# EAGLE board SDA396 (EAGLE 9.6.2), part 1 of 5
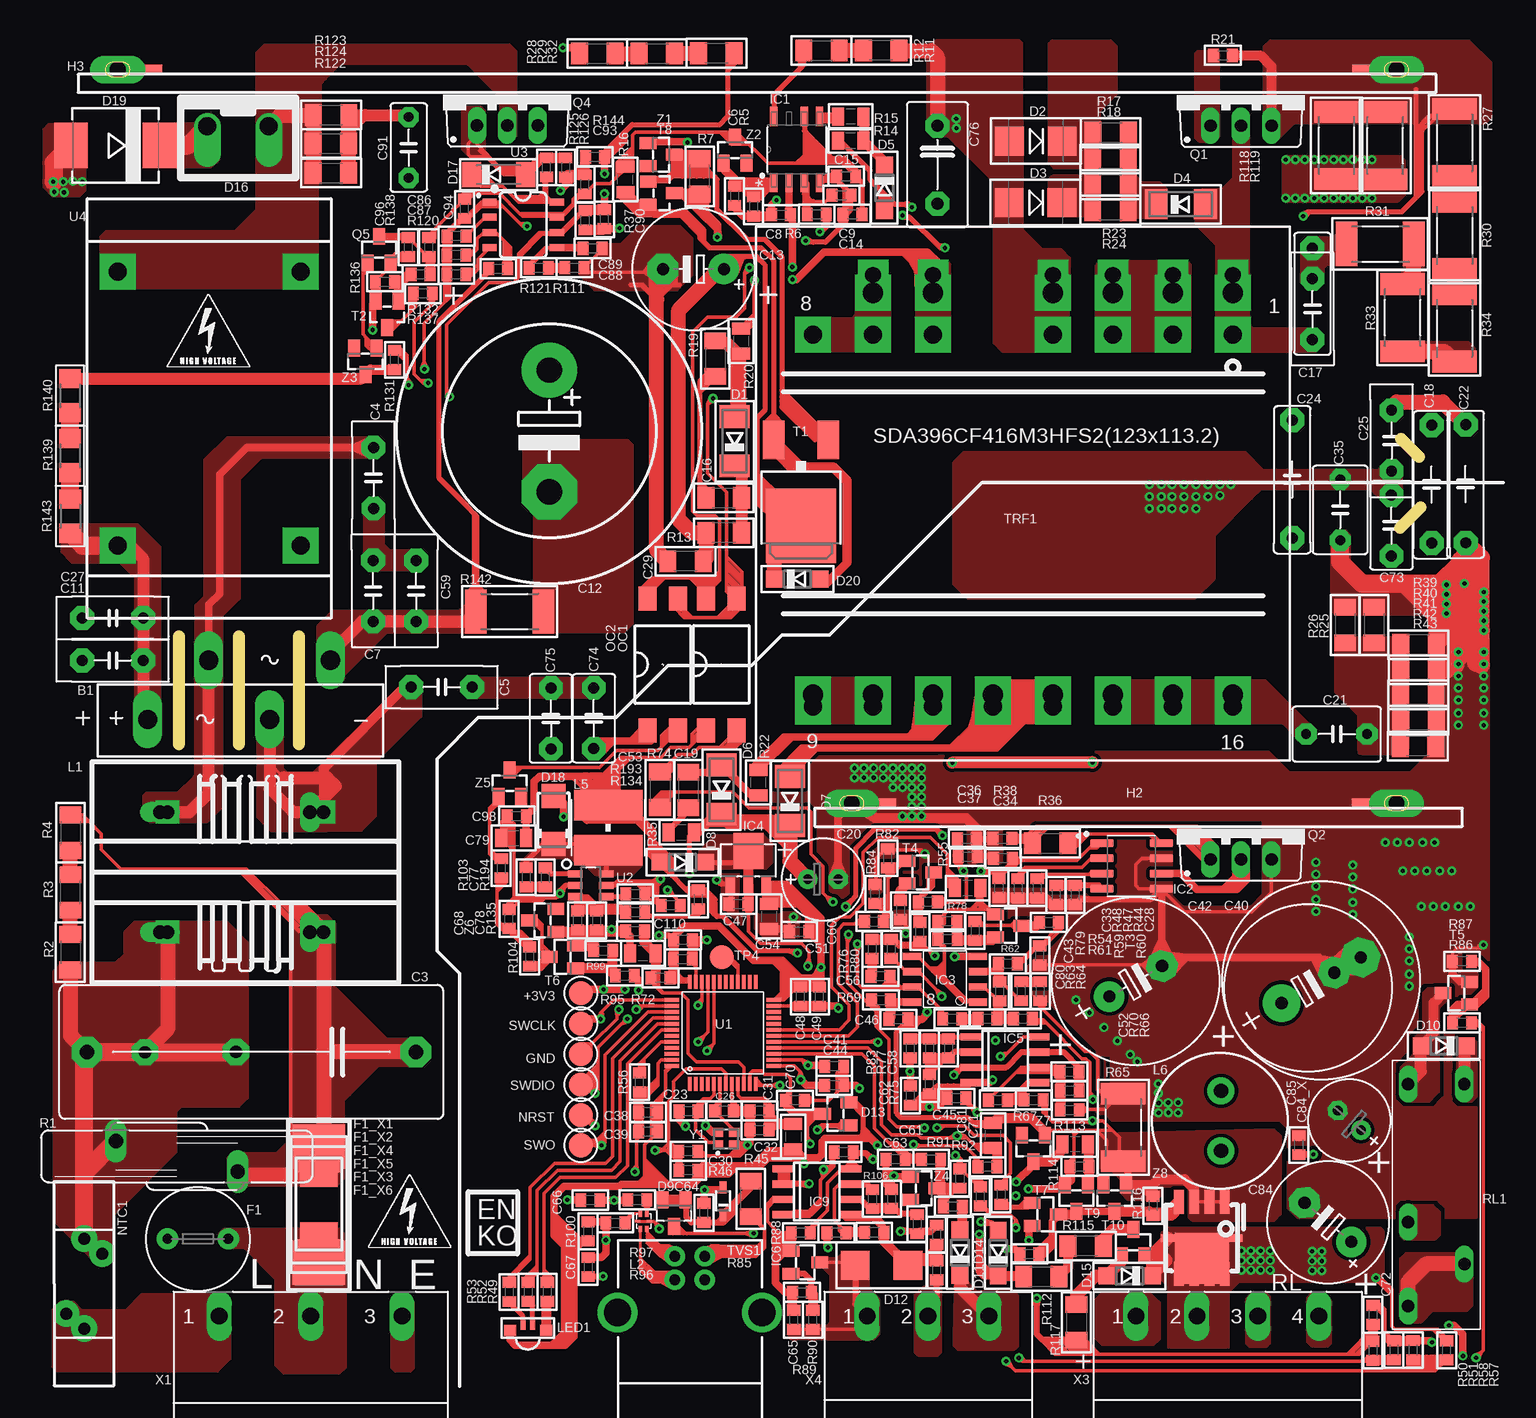
[diagram p3: board, top side]
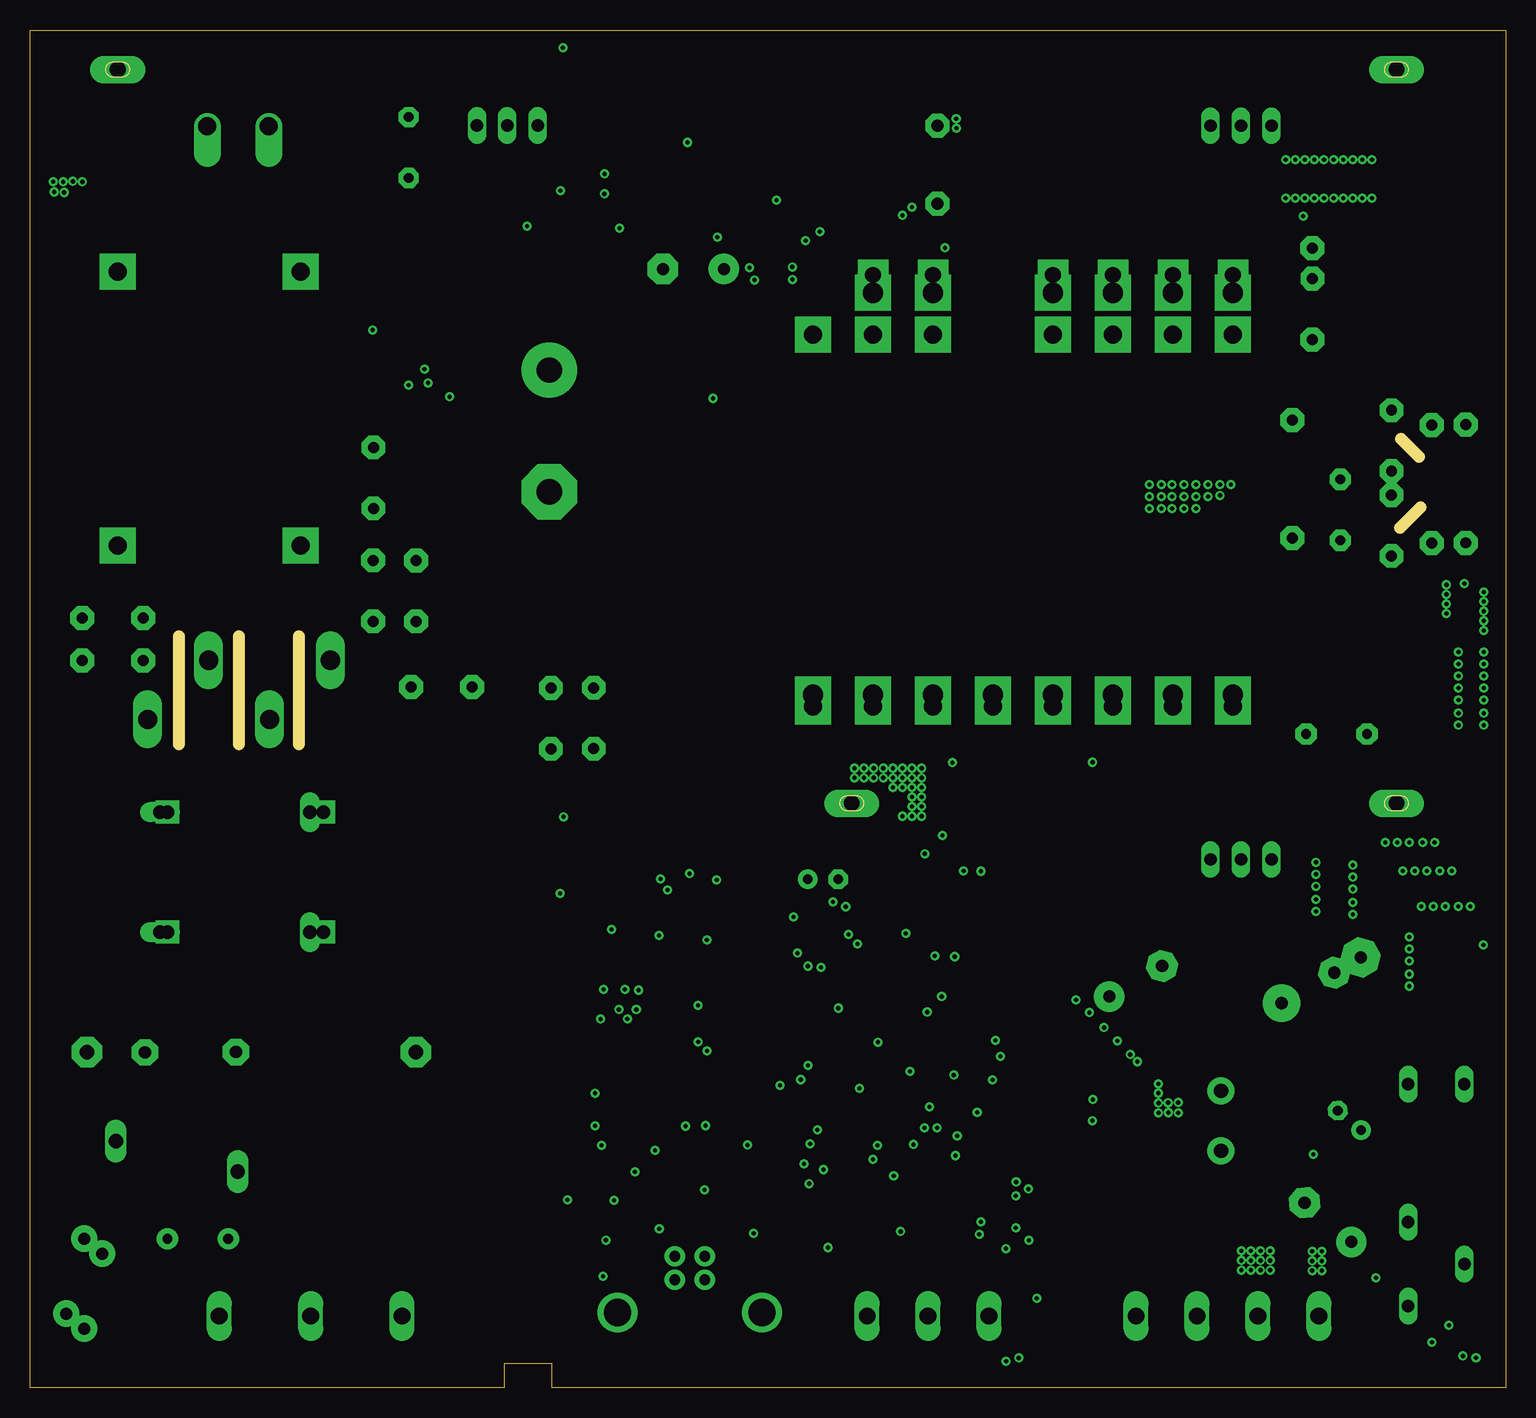
[diagram p4: board, inner layer Route3]
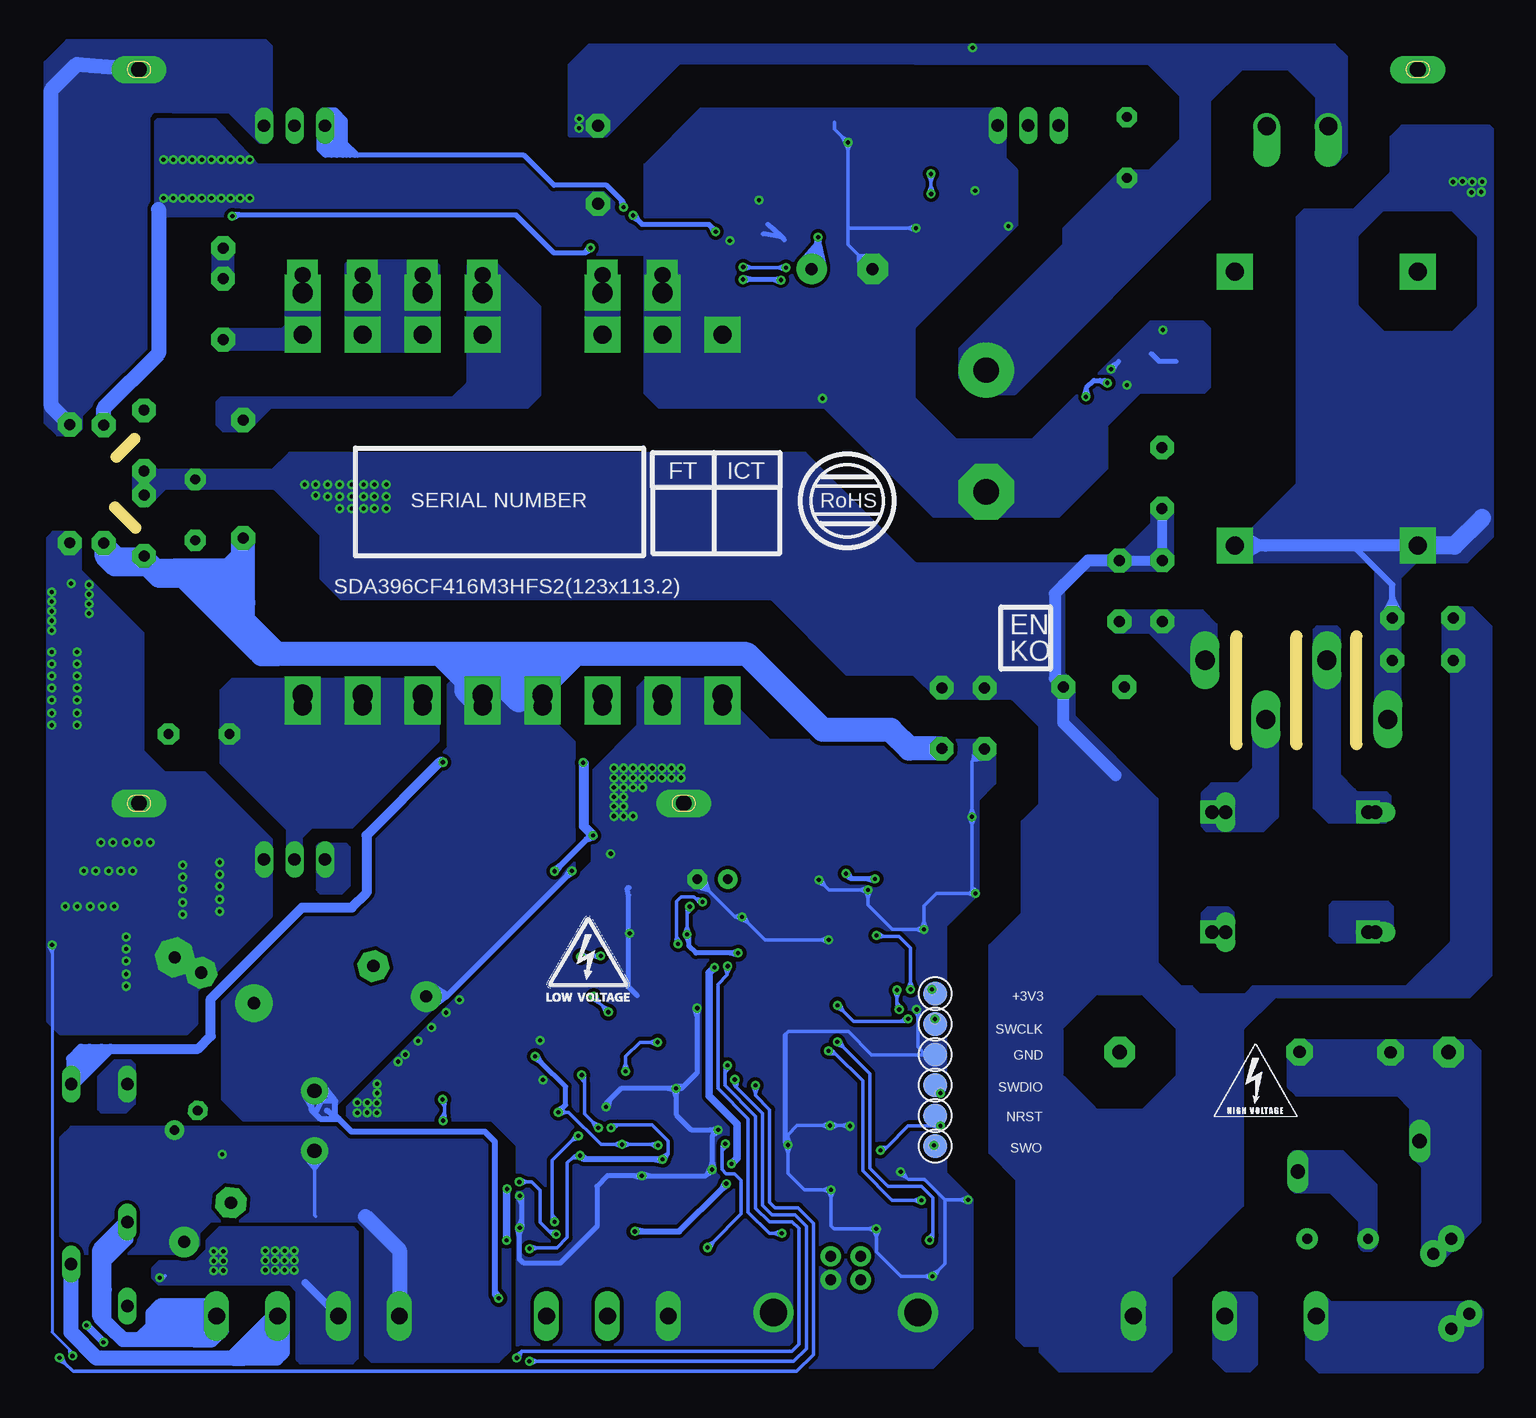
[diagram p5: board, bottom side, seen from below]

No outline drawn. Coordinates in mm, seen from the top.
Copper layers (1*16): Top 0.035mm / dielectric 1.53mm / Bottom 0.035mm
Design rules "default *": minimum track width 10mil, minimum drill 0.008890625mm, track to track 11mil, track to pad 11mil, pad to pad 11mil, via to via 11mil, smd to smd 11mil, copper to edge 6mil, drill to drill 8mil, minimum pad ring 10mil, minimum via ring 8mil, stop-mask expansion 4mil, vias tented up to drill 0.35mm, thermal gap 10mil
Milling: 2 lines

## Footprints (pad centres in the part's own frame; a part is rotated, then mirrored left to right if it is on the bottom)
DıODE_BRIDGE_8A_DIK = drill 1.6 long: + -7.62,0.08; - 7.62,5; AC1 -2.54,5; AC2 2.54,0.08
C275-113X316_&_C150-072X183_&_C225-113X268 = drill 1.194 pad 2.54 octagon: 1 -13.716,0; 2 13.716,0 | drill 1.016 pad 2.184 octagon: 3 -13.733,0.02; 4 8.873,0.02; 5 -13.693,0; 6 1.293,0
C50-035X75 = drill 0.914 pad 1.981 octagon: 1 -2.54,0; 2 2.54,0
C0603_ENKO = smd 0.9 x 1.1: 1 -0.794,0; 2 0.794,0
EB25D = drill 2.1 pad 4.597: + -5.08,0 | drill 2.1 pad 4.597 octagon: - 5.08,0
E5-10,5 = drill 1.016 pad 2.54: + -2.54,0 | drill 1.016 pad 2.54 octagon: - 2.54,0
C1206_ENKO = smd 1.4 x 1.8: 1 -1.479,0; 2 1.479,0
C075-32X103/C050-035X75 = drill 0.914 pad 2 octagon: 1 -3.81,0; 2 3.81,0 | drill 0.914 pad 1.981 octagon: 3 -3.81,0; 4 1.27,0
C075-32X103_DEIF = drill 0.914 pad 2 octagon: P$1 -4.92,0; P$2 4.92,0
E2,5-7 = drill 0.813 pad 1.6: + -1.27,0 | drill 0.813 pad 1.6 octagon: - 1.27,0
C050-045X075 = drill 0.813 pad 1.778 octagon: 1 -2.54,0; 2 2.54,0
E5-13/E7,5-16 = drill 1.016 pad 3.15: + -3.81,0 | drill 1.016 pad 2.54: +1 -3.81,0 | drill 1.016 pad 3.15 octagon: - 3.81,0 | drill 1.016 pad 2.54 octagon: -1 1.27,0
E5-13 = drill 1.016 pad 2.54: + -2.54,0 | drill 1.016 pad 2.54 octagon: - 2.54,0
C0805_ENKO = smd 1 x 1.5: 1 -1.052,0; 2 1.052,0
C050-035X075 = drill 0.914 pad 1.981 octagon: 1 -2.54,0; 2 2.54,0
C065-052X106 = drill 1 pad 2 octagon: 1 -3.25,0; 2 3.25,0
C050-030X075 = drill 0.813 pad 1.676 octagon: 1 -2.54,0; 2 2.54,0
M7_DC_DIYOT = smd 1.9 x 2.5: A -2.05,0; C 2.05,0
SMB = smd 2.4 x 2.4: A 2.2,0; C -2.2,0
SOD123 = smd 1.4 x 1.4: A 1.9,0; C -1.9,0
SOT23 = smd 1 x 1.4: 1 -0.95,-1.1; 2 0.95,-1.1; 3 0,1.1
TRANSIL_SMB = smd 2.4 x 2.4: A 2.2,0; A1 -2.2,0
DIODE_12A_1000V_TO220 = drill 1.5 pad 2.184 offset: A 1.27,-2.54; K 1.27,2.59
SOD106-R = smd 1.6 x 2.1: A 2.25,0; C -2.25,0
SMA = smd 2 x 2: A 2,0; C -2,0
SMC = smd 2.8 x 3.8: A 3.7,0; C -3.7,0
SENS_FUSE = drill 0.813 pad 1.778: 1 -2.54,0; 2 2.54,0
FUSE_0678D = smd 3.81 x 4.06: P$1 4.6,0; P$2 -4.81,0
FUSE_1025FA = smd 3.3 x 4.38: P$1 5.045,0; P$2 -5.045,0
FUSE_EBF_FUSE_446/447 = smd 1.44 x 4.03: P$1 3.67,0; P$2 -3.68,0
FUSE_OMF250 = smd 3.6 x 4.4: P$1 4.8,0; P$2 -4.8,0
FUSE_UMF250 = smd 2 x 3.75: P$1 4.25,0; P$2 -4.25,0
FUSE_TYPE0679H = smd 1.96 x 3.15: P$1 2.455,0; P$2 -2.455,0
DEIF_SOGUTUCU_2 = drill 1.3 pad 2.3 long: 1 -23.9,0.91; 3 21.5,0.91 | smd 4.3 x 0.8: 2 -22.35,0.91; 4 19.95,0.91
DEIF_SOGUTUCU_300W = drill 1.3 pad 2.3 long: 1 -54.49,1.15; 3 52.11,1.15 | smd 4.3 x 0.8: 2 -52.94,1.15; 4 50.56,1.15
NCP1239_SMPS_IC = smd 1.6 x 0.6: 1 -2.76,1.905; 2 -2.76,0.635; 3 -2.76,-0.635; 4 -2.76,-1.905; 5 2.76,-1.905; 6 2.76,-0.635; 8 2.76,1.905
NCP4306 = smd 1.97 x 0.6: 1 -2.475,1.905; 2 -2.475,0.635; 3 -2.475,-0.635; 4 -2.475,-1.905; 5 2.475,-1.905; 6 2.475,-0.635; 7 2.475,0.635; 8 2.475,1.905
SO-8 = smd 1.524 x 0.61: 1 -2.743,1.92; 2 -2.743,0.65; 3 -2.743,-0.62; 4 -2.743,-1.89; 5 2.743,-1.89; 6 2.743,-0.62; 7 2.743,0.65; 8 2.743,1.92
SOT89 = smd 0.8 x 1.5: 1 -1.5,-1.75; 2 0,-1.75; 3 1.5,-1.75 | smd 2.5 x 3: 4 0,1.05
SO08 = smd 0.6 x 1.8: 1 -1.905,-2.8; 2 -0.635,-2.8; 3 0.635,-2.8; 4 1.905,-2.8; 5 1.905,2.8; 6 0.635,2.8; 7 -0.635,2.8; 8 -1.905,2.8
TL431_SOT23F = smd 1 x 1.4: A 0,1.2; C -0.95,-1.2; R 0.95,-1.2
TPH6R30ANL = smd 0.8 x 2: D 1.905,3; D1 0.635,3; D2 -0.635,3; D3 -1.905,3; GATE 1.905,-3; S -1.905,-3; S1 -0.635,-3; S2 0.635,-3 | smd 1.27 x 0.635: P$1 -2.75,0; P$2 2.75,0 | smd 4.5 x 4.25: P$3 0,1.7
UU1620_&_FWCMET24V_DEIF150W = drill 1.1 pad 1.93 square: 1 -5,-6.5; 2 5,-6.5; 3 -5,6.5; 4 5,6.5 | drill 1.118 long: 5 -5,-5.385; 6 5,-5.385; 7 4.999,7.115; 8 -5.001,7.113
EXC24CS_COMMON_MODE = smd 0.4 x 0.2: 1 -0.5,0; 4 0.5,0 | smd 0.3 x 0.5: 2 -0.275,-0.625; 3 0.275,-0.625; 5 0.275,0.625; 6 -0.275,0.625
WE-PD2_5MM = smd 2.55 x 5.7: 1 -1.875,0; 2 1.875,0
INDUCTOR-NEOSID = drill 1.2 pad 2.25: 1 -2.5,0.1; 2 2.5,0.1
KPFA-3010RGBC-11 = smd 1 x 0.9: 1 1.5,-0.2; 2 -1.5,-0.2 | smd 0.4 x 0.8: 3 -0.4,0.25; 4 0.4,0.25
NTC_15R_2A_&_N15SP005-5 = drill 1 pad 2.184: P$1 -2.5,1.5; P$2 2.5,-1.5; P$3 3.75,0; P$4 -3.75,0
PS2561DL2-1_OPTO1 = smd 1.5 x 2: 1 -1.27,-5.5; 2 1.27,-5.5; 3 1.27,5.5; 4 -1.27,5.5
PROG_6PIN = smd 2 x 2: 1 0,6.35; 2 0,3.81; 3 0,1.27; 4 0,-1.27; 5 0,-3.81; 6 0,-6.35
TO220BV = drill 1.016 long: D 0,-2.54; G -2.54,-2.54; S 2.54,-2.54
S20K40 = drill 1.194 long: 1 -1.27,-5.08; 2 1.27,5.08
R1206_ENKO = smd 1.4 x 1.8: 1 -1.479,0; 2 1.479,0
R0603_ENKO = smd 0.9 x 1.1: 1 -0.794,0; 2 0.794,0
R0805_ENKO = smd 1 x 1.5: 1 -1.052,0; 2 1.052,0
R2512 = smd 1.8 x 3.7: 1 -2.8,0; 2 2.8,0
R1206 = smd 1.6 x 1.803: 1 -1.422,0; 2 1.422,0
ALD1_AND_ALJ_RELAY = drill 1.016 pad 1.27 long: 1 -8.997,-2.129; 2 -8.998,2.565; P0 9.505,-2.132; P1 6.007,2.571; S0 2.507,-2.129
DPAK = smd 1.8 x 3.2: 1 -2.28,-4.8; 3 2.28,-4.8 | smd 5.8 x 6.2: 4 0,2.38
SOT-23 = smd 1 x 1.4: 1 0,1.1; 2 0.95,-1.1; 3 -0.95,-1.1
SOT23-BEC = smd 1 x 1.4: B -0.95,-1.1; C 0,1.1; E 0.95,-1.1
TP20R = smd 2 x 2: TP 0,0
DEIF_TRF = drill 1.7 pad 3 square: 1 -16.75,12.5; 2 -16.75,7.5; 3 -16.75,2.5; 5 -16.75,-7.5; 6 -16.75,-12.5; 6.5 16.75,-17.5; 7 16.75,-12.5; 8 16.75,-7.5; 9 16.75,-2.5; 10 16.75,2.5; 11 16.75,7.5; 12 16.75,12.5; 13 16.75,17.5; 55 -16.75,17.5 | drill 1.5 pad 3 square: 6.1 17.745,-17.5; 6.2 16.75,-17.5; 19 17.745,12.5; 20 17.745,7.5; 21 17.745,2.5; 22 17.745,-2.5; 23 17.745,-7.5; 24 17.745,-12.5; 25 17.745,17.5; 27 16.75,-12.5; 28 16.75,-7.5; 29 16.75,-2.5; 30 16.75,2.5; 31 16.75,7.5; 32 16.75,12.5; 38 16.75,17.5; 40 16.75,-17.5; 41 16.75,-12.5; 42 16.75,-7.5; 43 16.75,-2.5; 44 16.75,2.5; 45 16.75,7.5; 46 16.75,12.5; 47 16.75,17.5; 48 -13.25,-17.5; 49 -13.25,-12.5; 50 -13.25,-7.5; 52 -13.25,2.5; 53 -13.25,7.5; 54 -13.25,12.5; 58 -13.25,17.5 | drill 1.3 pad 2.54 square: 14 -18.255,-12.5; 15 -18.255,-7.5; 16 -18.255,2.5; 17 -18.255,7.5; 18 -18.255,12.5; 33 -18.25,-12.5; 34 -18.25,-7.5; 35 -18.25,2.5; 36 -18.25,7.5; 37 -18.25,12.5; 56 -18.255,17.5; 57 -18.25,17.5
SOD323 = smd 1 x 0.6: A 1.143,0; C -1.143,0
STM32F072CXXX_LQFP48 = smd 0.3 x 1.2: 1 -2.75,-4.25; 2 -2.25,-4.25; 3 -1.75,-4.25; 4 -1.25,-4.25; 5 -0.75,-4.25; 6 -0.25,-4.25; 7 0.25,-4.25; 8 0.75,-4.25; 9 1.25,-4.25; 10 1.75,-4.25; 11 2.25,-4.25; 12 2.75,-4.25; 25 2.75,4.25; 26 2.25,4.25; 27 1.75,4.25; 28 1.25,4.25; 29 0.75,4.25; 30 0.25,4.25; 31 -0.25,4.25; 32 -0.75,4.25; 33 -1.25,4.25; 34 -1.75,4.25; 35 -2.25,4.25; 36 -2.75,4.25 | smd 1.2 x 0.3: 13 4.25,-2.75; 14 4.25,-2.25; 15 4.25,-1.75; 16 4.25,-1.25; 17 4.25,-0.75; 18 4.25,-0.25; 19 4.25,0.25; 20 4.25,0.75; 21 4.25,1.25; 22 4.25,1.75; 23 4.25,2.25; 24 4.25,2.75; 37 -4.25,2.75; 38 -4.25,2.25; 39 -4.25,1.75; 40 -4.25,1.25; 41 -4.25,0.75; 42 -4.25,0.25; 43 -4.25,-0.25; 44 -4.25,-0.75; 45 -4.25,-1.25; 46 -4.25,-1.75; 47 -4.25,-2.25; 48 -4.25,-2.75
AOZ1282CI-1 = smd 1.2 x 0.6: 1 -1.298,0.95; 2 -1.298,0; 3 -1.298,-0.95; 4 1.298,-0.95; 5 1.298,0; 6 1.298,0.95
UCC28180 = smd 0.6 x 1.2: 1 -1.905,-2.8; 2 -0.635,-2.8; 3 0.635,-2.8; 4 1.905,-2.8; 5 1.905,2.8; 6 0.635,2.8; 7 -0.635,2.8; 8 -1.905,2.8
0077930A7 = drill 1.5 pad 3 square: 1 -11.43,7.62; 2 11.43,7.62; 3 -11.43,-7.62; 4 11.43,-7.62
GMSTBA3 = drill 1.397 long: 1 -7.62,5.08; 2 0,5.08; 3 7.62,5.08
USB_B(YATIK) = drill 0.914 pad 1.676: D+ 4,1.25; D- 5.981,1.25; GND 4,-1.25; VBUS 5.981,-1.25 | drill 2.286: SHLD1 1.282,-6.02; SHLD2 1.282,6.02
MSTBA4 = drill 1.397 long: 1 -7.62,5.08; 2 -2.54,5.08; 3 2.54,5.08; 4 7.62,5.08
MSTBA3 = drill 1.397 long: 1 -5.08,5.08; 2 0,5.08; 3 5.08,5.08
NX2016SA-32M = smd 0.85 x 0.75: 1 -0.675,-0.525; 2 0.675,-0.525; 3 0.675,0.525; 4 -0.675,0.525

## Placement (x,y rotation side)
B1  0119-1152**DIODE BRIDGE 8A 800V 4-SIP, GBU  [DıODE_BRIDGE_8A_DIK]  -105.57,55.65 0 top
C3  0019-2209**CAP TH POLY 2.2uF 305Vac %10 X2 Metalize PP F=27.5mm (32x25x13)  [C275-113X316_&_C150-072X183_&_C225-113X268]  -104.55,28 180 top
C4  0019-1391**CAP TH CER 4700pF 250VAC 2.5kVDC X1Y2 %20 85C F=5mm  [C50-035X75]  -94.37,75.86 90 top
C5  0019-1391**CAP TH CER 4700pF 250VAC 2.5kVDC X1Y2 %20 85C F=5mm  [C50-035X75]  -88.68,58.42 0 top
C6  1200920252**CAP 0603 CER 1nF 50V %10 X7R  [C0603_ENKO]  -64.27,99.37 270 top
C7  0019-1391**CAP TH CER 4700pF 250VAC 2.5kVDC X1Y2 %20 85C F=5mm  [C50-035X75]  -94.4,66.45 270 top
C8  1200920252**CAP 0603 CER 1nF 50V %10 X7R  [C0603_ENKO]  -60.39,97.8 180 top
C9  1200920371**CAP 0603 CER 150p 50V%5 COG  [C0603_ENKO]  -55.36,99.42 180 top
C11  0019-1391**CAP TH CER 4700pF 250VAC 2.5kVDC X1Y2 %20 85C F=5mm  [C50-035X75]  -116.11,60.65 0 top
C12  1200920352**CAP TH AL. ELEC 100uF 450V %20 105C SNP F=10/25.4X30  [EB25D]  -79.72,79.78 270 top
C13  0019-2196**CAP TH AL ELEC 47uF 100V %20 105C F=5/10x16  [E5-10,5]  -67.69,93.26 180 top
C14  1200920567**CAP 0603 CER 1uF 25V %10X7R  [C0603_ENKO]  -54.44,97.83 180 top
C15  1200920268**CAP 0603 CER 100nF 50V %10 X7R  [C0603_ENKO]  -54.97,101 180 top
C16  NC**TAKILMAYACAK (Not Fitted)  [C1206_ENKO]  -65.17,74.19 180 top
C17  0019-1393**CAP TH CER 270pF 630V COG,NPO RADIAL %5 125C F=5mm  [C075-32X103/C050-035X75]  -16.09,91.21 90 top
C18  1200920292**CAP TH CER 2.2nF 300Vac %20 X1Y2 F=7.5mm DxS(13x5)  [C075-32X103_DEIF]  -6.16,75.33 90 top
C19  1200920078**CAP 1206 CER 1nF 50V %10 X7R  [C1206_ENKO]  -68.12,49.84 90 top
C20  1200920283**CAP TH AL. ELEC 47uF 50V %20 105C L?1000H F=2.5/6.3x11  [E2,5-7]  -56.9,42.4 0 top
C21  0019-3003**CAP TH CER 3.3nF 2000VDC %10 Y5P/Y5E F=5mm  [C050-045X075]  -14.08,54.51 0 top
C22  NC**TAKILMAYACAK (Not Fitted)  [C075-32X103_DEIF]  -3.33,75.37 90 top
C23  1019-3352**CAP 0603 CER 22pF 50V %5 NPO  [C0603_ENKO]  -68.11,23.08 180 top
C24  1200920292**CAP TH CER 2.2nF 300Vac %20 X1Y2 F=7.5mm DxS(13x5)  [C075-32X103_DEIF]  -17.78,75.75 90 top
C25  0019-1391**CAP TH CER 4700pF 250VAC 2.5kVDC X1Y2 %20 85C F=5mm  [C50-035X75]  -9.5,78.96 90 top
C26  1019-3352**CAP 0603 CER 22pF 50V %5 NPO  [C0603_ENKO]  -65.14,23.09 0 top
C27  NC**TAKILMAYACAK (Not Fitted)  [C50-035X75]  -116.11,64.17 0 top
C28  1200920268**CAP 0603 CER 100nF 50V %10 X7R  [C0603_ENKO]  -35.88,41.1 90 top
C29  NC**TAKILMAYACAK (Not Fitted)  [C1206_ENKO]  -68.36,68.91 0 top
C30  1200920268**CAP 0603 CER 100nF 50V %10 X7R  [C0603_ENKO]  -68.12,19.73 180 top
C31  1200920268**CAP 0603 CER 100nF 50V %10 X7R  [C0603_ENKO]  -62.18,23.1 180 top
C32  1019-3167**CAP 0603 CER 10nF 50V %10 X7R (AbC)  [C0603_ENKO]  -62.19,21.51 180 top
C33  1200920268**CAP 0603 CER 100nF 50V %10 X7R  [C0603_ENKO]  -42.23,41.68 90 top
C34  1200920567**CAP 0603 CER 1uF 25V %10X7R  [C0603_ENKO]  -41.89,44.14 0 top
C35  0019-1391**CAP TH CER 4700pF 250VAC 2.5kVDC X1Y2 %20 85C F=5mm  [C050-045X075]  -13.77,73.2 90 top
C36  1200920268**CAP 0603 CER 100nF 50V %10 X7R  [C0603_ENKO]  -44.89,45.77 0 top
C37  1200920268**CAP 0603 CER 100nF 50V %10 X7R  [C0603_ENKO]  -44.84,44.3 0 top
C38  1200920268**CAP 0603 CER 100nF 50V %10 X7R  [C0603_ENKO]  -71.48,22.97 180 top
C39  1019-3167**CAP 0603 CER 10nF 50V %10 X7R (AbC)  [C0603_ENKO]  -71.48,21.36 180 top
C40  0019-3054**CAP TH AL ELEC 1000uF 35V %20 105C F=5/16x20 LOW ESR [ARGE?]  [E5-13/E7,5-16]  -15.37,33.98 30 top
C41  1200920268**CAP 0603 CER 100nF 50V %10 X7R  [C0603_ENKO]  -55.95,26.81 0 top
C42  0019-3054**CAP TH AL ELEC 1000uF 35V %20 105C F=5/16x20 LOW ESR [ARGE?]  [E5-13]  -30.83,33.9 30 top
C43  1019-3387**CAP 0603 CER 10uF 10V %10 X5R  [C0603_ENKO]  -38.83,36.05 90 top
C44  1200920268**CAP 0603 CER 100nF 50V %10 X7R  [C0603_ENKO]  -55.97,25.23 0 top
C45  1200920268**CAP 0603 CER 100nF 50V %10 X7R  [C0603_ENKO]  -45.77,24.16 180 top
C46  1200920268**CAP 0603 CER 100nF 50V %10 X7R  [C0603_ENKO]  -50.61,30.73 180 top
C47  1200920567**CAP 0603 CER 1uF 25V %10X7R  [C0603_ENKO]  -63.93,40.33 180 top
C48  1019-3167**CAP 0603 CER 10nF 50V %10 X7R (AbC)  [C0603_ENKO]  -58.78,32.62 270 top
C49  1200920268**CAP 0603 CER 100nF 50V %10 X7R  [C0603_ENKO]  -57.2,32.62 270 top
C50  NC**TAKILMAYACAK (Not Fitted)  [C0603_ENKO]  -36.35,26.36 0 top
C51  1200920268**CAP 0603 CER 100nF 50V %10 X7R  [C0603_ENKO]  -58.88,38.04 180 top
C52  1200920567**CAP 0603 CER 1uF 25V %10X7R  [C0603_ENKO]  -46.13,30.77 180 top
C53  1200920268**CAP 0603 CER 100nF 50V %10 X7R  [C0603_ENKO]  -72.57,38.08 180 top
C54  1019-3301**CAP 0805 47uF 6.3V %20 X5R  [C0805_ENKO]  -61.41,39.3 270 top
C55  1019-3167**CAP 0603 CER 10nF 50V %10 X7R (AbC)  [C0603_ENKO]  -68.58,35.76 0 top
C56  1019-3167**CAP 0603 CER 10nF 50V %10 X7R (AbC)  [C0603_ENKO]  -52.11,34.31 0 top
C57  1200920268**CAP 0603 CER 100nF 50V %10 X7R  [C0603_ENKO]  -68.57,37.35 0 top
C58  1200920371**CAP 0603 CER 150p 50V%5 COG  [C0603_ENKO]  -46.43,28.3 90 top
C59  0019-1391**CAP TH CER 4700pF 250VAC 2.5kVDC X1Y2 %20 85C F=5mm  [C50-035X75]  -90.81,66.44 270 top
C60  1019-3387**CAP 0603 CER 10uF 10V %10 X5R  [C0603_ENKO]  -52.56,41.18 270 top
C61  1200920268**CAP 0603 CER 100nF 50V %10 X7R  [C0603_ENKO]  -55.16,19.66 180 top
C62  1200920268**CAP 0603 CER 100nF 50V %10 X7R  [C0603_ENKO]  -49.61,24.38 90 top
C63  1019-3167**CAP 0603 CER 10nF 50V %10 X7R (AbC)  [C0603_ENKO]  -50.84,19.06 180 top
C64  1200920268**CAP 0603 CER 100nF 50V %10 X7R  [C0603_ENKO]  -66.83,14.59 90 top
C65  1200920268**CAP 0603 CER 100nF 50V %10 X7R  [C0603_ENKO]  -59.34,5.67 90 top
C66  1019-3381**CAP 0603 CER 33pf 50V %5 NPO(COG)  [C0603_ENKO]  -76.29,15.66 180 top
C67  1019-3381**CAP 0603 CER 33pf 50V %5 NPO(COG)  [C0603_ENKO]  -76.47,10.08 270 top
C68  1200920268**CAP 0603 CER 100nF 50V %10 X7R  [C0603_ENKO]  -83.07,39.1 270 top
C69  1200920268**CAP 0603 CER 100nF 50V %10 X7R  [C0603_ENKO]  -43.77,15.96 90 top
C70  1200920268**CAP 0603 CER 100nF 50V %10 X7R  [C0603_ENKO]  -59.23,23.98 180 top
C71  1200920082**CAP 0805 CER 100nF 50V %10 X7R  [C0805_ENKO]  -42.71,21.06 90 top
C72  1019-3167**CAP 0603 CER 10nF 50V %10 X7R (AbC)  [C0603_ENKO]  -11.05,6.1 270 top
C73  0019-1391**CAP TH CER 4700pF 250VAC 2.5kVDC X1Y2 %20 85C F=5mm  [C050-035X075]  -9.51,71.9 90 top
C74  NC**TAKILMAYACAK (Not Fitted)  [C050-035X075]  -76,55.83 90 top
C75  NC**TAKILMAYACAK (Not Fitted)  [C050-035X075]  -79.58,55.81 270 top
C76  0019-1391**CAP TH CER 4700pF 250VAC 2.5kVDC X1Y2 %20 85C F=5mm  [C065-052X106]  -47.36,101.98 270 top
C77  1200920268**CAP 0603 CER 100nF 50V %10 X7R  [C0603_ENKO]  -81.64,42.56 90 top
C78  1200920271**CAP 0603 CER 10pF 50V%10 COG  [C0603_ENKO]  -77.36,38.98 270 top
C79  1019-3243**CAP 0805 CER 10uF 50V ±10% X5R -55°C ~ 85°C  [C0805_ENKO]  -82.69,45.84 0 top
C80  NC**TAKILMAYACAK (Not Fitted)  [C0603_ENKO]  -42.17,33.05 90 top
C81  NC**TAKILMAYACAK (Not Fitted)  [C0603_ENKO]  -42.31,23.99 0 top
C84  1019-5003**CAP.EL.470uF 35V 10X10.5 20% SMD  [E5-10,5]  -14.8,13.8 140 top
C84_X  [E2,5-7]  -13.01,22.31 140 top
C85  1200920268**CAP 0603 CER 100nF 50V %10 X7R  [C0603_ENKO]  -17.23,20.24 90 top
C86  1409-0021**CAP 0603 CER 2.2nf 50V %10 X7R  [C0603_ENKO]  -87.44,96.03 180 top
C87  1019-3157**CAP 0603 CER 1.5nF 50V %10 X7R (AbC)  [C0603_ENKO]  -87.46,94.44 180 top
C88  1200920558**CAP 0603 CER 10u 25V %20 X5R  [C0603_ENKO]  -77.62,93.38 0 top
C89  1019-3362**CAP 0603 CER 2.2uF 10V %10 X5R  [C0603_ENKO]  -76.1,94.99 0 top
C90  1409-0019**CAP 0603 CER 390pf 50V %5 NPO(COG)  [C0603_ENKO]  -75.12,97.42 270 top
C91  NC**Takılmayacak  [C050-030X075]  -91.43,103.41 270 top
C93  1200920558**CAP 0603 CER 10u 25V %20 X5R  [C0603_ENKO]  -76.75,100.33 90 top
C94  1200920268**CAP 0603 CER 100nF 50V %10 X7R  [C0603_ENKO]  -86.78,98.29 270 top
C96  1200920640**CAP 0603 1UF 50V %10 X7R  [C0603_ENKO]  -91.46,95.1 270 top
C98  1200920252**CAP 0603 CER 1nF 50V %10 X7R  [C0603_ENKO]  -82.42,47.66 0 top
C110  1200920268**CAP 0603 CER 100nF 50V %10 X7R  [C0603_ENKO]  -69.58,40.23 180 top
D1  1200980554**DIODE SWITCHING SM 1000V 1A US1M  [M7_DC_DIYOT]  -64.25,78.91 270 top
D2  1119-3023**TVS DIODE SMB P6SMB200A-TKS (Reverse Standoff Voltage 171V) ( MAXIMUM CLAMPING 274V)  [SMB]  -39.16,103.94 180 top
D3  1119-3023**TVS DIODE SMB P6SMB200A-TKS (Reverse Standoff Voltage 171V) ( MAXIMUM CLAMPING 274V)  [SMB]  -39.18,98.81 180 top
D4  1200980554**DIODE SWITCHING SM 1000V 1A US1M  [M7_DC_DIYOT]  -27.07,98.66 180 top
D5  1200980377**DIODE SWITCHING SMD 75V 200mA SOD-123 1N4148W  [SOD123]  -51.78,100.05 270 top
D6  1200980554**DIODE SWITCHING SM 1000V 1A US1M  [M7_DC_DIYOT]  -65.35,49.87 270 top
D7  1200980468**DIODE RECTIFIER SMD 1000V 1A GS1M  [M7_DC_DIYOT]  -59.66,48.93 270 top
D8  1200980377**DIODE SWITCHING SMD 75V 200mA SOD-123 1N4148W  [SOD123]  -68.59,43.82 180 top
D9  1119-3027**DIODE 75V 200MA SOT23 BAS16 (AbC)  [SOT23]  -69.32,14.57 180 top
D10  1200980377**DIODE SWITCHING SMD 75V 200mA SOD-123 1N4148W  [SOD123]  -5.15,28.52 180 top
D11  1200980377**DIODE SWITCHING SMD 75V 200mA SOD-123 1N4148W  [SOD123]  -45.48,11.28 90 top
D12  1039-3023**DIODE TVS 600W 12V DO214AA BIPOLAR  [TRANSIL_SMB]  -52.01,10.22 0 top
D13  1200980593**DIODE SCHOTTKY BARRIER DOUBLE SMD 30V 200mA BAT54S  [SOT23]  -55.84,22.84 90 top
D14  1200980377**DIODE SWITCHING SMD 75V 200mA SOD-123 1N4148W  [SOD123]  -42.29,11.24 90 top
D15  1200980377**DIODE SWITCHING SMD 75V 200mA SOD-123 1N4148W  [SOD123]  -31.34,9.34 180 top
D16  0119-5001**Diode SIC Schottky 600V 4A TO220-2 C3D04060A  [DIODE_12A_1000V_TO220]  -105.64,103.9 90 top
D17  1200980565**DIODE SCHOTTKY SMD 40V 1A MBRA140T3G  [SOD106-R]  -83.95,101.14 0 top
D18  1200980432**DIODE SCHOTTKY RECTIFIER SMD SMA/DO_214AC 60V 2A STPS2L60A  [SMA]  -79.36,47.33 90 top
D19  1119-3040**800V 8A SMC DIODE S8KC-13 Diodes (AbC) (MX322)  [SMC]  -115.89,103.58 180 top
D20  1200980377**DIODE SWITCHING SMD 75V 200mA SOD-123 1N4148W  [SOD123]  -59.03,67.43 0 top
F1  0169-2042**SIGORTA 5A FAST-ACTING TR5 SERISI SILINDIRIK TIP  [SENS_FUSE]  -109.01,12.43 0 top
F1_X1  NC *** TAKILMAYACAK (Not Fitted)  [FUSE_0678D]  -98.92,15.28 90 top
F1_X2  NC *** TAKILMAYACAK (Not Fitted)  [FUSE_1025FA]  -98.92,15.28 90 top
F1_X3  NC *** TAKILMAYACAK (Not Fitted)  [FUSE_EBF_FUSE_446/447]  -98.92,15.28 90 top
F1_X4  NC *** TAKILMAYACAK (Not Fitted)  [FUSE_OMF250]  -98.92,15.28 90 top
F1_X5  NC *** TAKILMAYACAK (Not Fitted)  [FUSE_UMF250]  -98.92,15.28 90 top
F1_X6  [FUSE_TYPE0679H]  -98.92,15.28 270 top
H2  0139-1110**DBC2 Heatsink [ARGE?]  [DEIF_SOGUTUCU_2]  -30.59,47.82 0 top
H3  [DEIF_SOGUTUCU_300W]  -61.2,108.75 0 top
IC1  1039-9014**IC SMPS CONTROLLER FLYBACK FIXED FREQ. ONSEMI NCP1239ED65R2G  [NCP1239_SMPS_IC]  -59.09,103.24 90 top
IC2  1039-9013**NCP4306AADZZZADR2G SOIC-8 (senkron IC) Synchronous Rectification Controller for Flyback  [NCP4306]  -31.17,43.51 0 top
IC3  1039-2224**TSM1011ID SO-8 Constant Voltage and Constant Current Controller  [SO-8]  -46.72,34.08 180 top
IC4  1039-3003**Voltage Regulator SOT-89 3.3V Diodes AP2204RA-3.3TRG1  [SOT89]  -63.12,43.73 0 top
IC5  1039-2009**OPAMP 3-32 V Dual 70C SO8 LM358  [SO08]  -41.72,27.36 270 top
IC6  1200980448**IC REGULATOR VOLTAGE SMD ZTL431AFFTA 2.5V %1  [TL431_SOT23F]  -58.37,10.46 270 top
IC8  1109-4211**Mosfet N-Ch 100V 90A Rds:3.7mR 8-SOP Advance (5x5) TPH3R70APL  [TPH6R30ANL]  -25.33,12.5 180 top
IC9  1039-2009**OPAMP 3-32 V Dual 70C SO8 LM358  [SO08]  -57.41,16.36 270 top
L1  0319-7445**LINE FILTER 2x5,9mH 4A 55mR 11.5mm COMMON MODE CHOKE Kemet SSRH24NVS-40059  [UU1620_&_FWCMET24V_DEIF150W]  -105.04,43 90 top
L2  1319-4100**EXC24 Common Mode Noise Filters with ESD Suppressor(0504 Size)  [EXC24CS_COMMON_MODE]  -71.85,13.9 0 top
L5  1319-4102**INDUCTOR POWER 22UH 4X4X1.8MM SMD  [WE-PD2_5MM]  -74.81,46.7 270 top
L6  INDUCTOR-NEOSID  [INDUCTOR-NEOSID]  -23.82,22.26 270 top
LED1  1209-0011**LED, RGB, Red, Green, Blue, SMD, 1mm x 3mm, 120 °, Dome, R 20mA, G 20mA, B 20mA (Right Angle)  [KPFA-3010RGBC-11]  -81.5,5 0 top
NTC1  0169-2029**SURGE PROTECTOR-In rush Current Limitter NTC N10SP005  [NTC_15R_2A_&_N15SP005-5]  -118.48,8.7 270 top
OC1  1200980560**OPTOCOUPLER SMD PS2561DL2-1Y-V-F3-A/L CTR: 200˜400  [PS2561DL2-1_OPTO1]  -65.37,60.31 0 top
OC2  1200980560**OPTOCOUPLER SMD PS2561DL2-1Y-V-F3-A/L CTR: 200˜400  [PS2561DL2-1_OPTO1]  -70.25,60.3 0 top
PCB1  0369-5034**PCB [ARGE?] SDA381V2CF416M3HFS2(123x113.2)  [PCB]  -153.47,107.58 0 top
PROG1  NC**TAKILMAYACAK (Not Fitted)  [PROG_6PIN]  -75.45,26.51 0 bottom
PROG2  NC**TAKILMAYACAK (Not Fitted)  [PROG_6PIN]  -77.1,26.57 0 top
Q1  0109-4091**Mosfet N-Ch 800V 9A 0.16R TO-220FP Vishay SIHA24N80AE-GE3 [ARGE?]  [TO220BV]  -22.05,107.76 0 top
Q2  0109-4112**Mosfet N-Ch 27.4A 150V Rds:19mR TO-220F Fairchild FDPF190N15A  [TO220BV]  -22.05,46.59 0 top
Q4  0109-4085**Mosfet N-Ch 600V 20.6A 190mohm TO-220 FCP190N60E  [TO220BV]  -83.21,107.78 0 top
Q5  1200980090**TRANS SMD NPN BC847B SOT-23  [SOT23]  -93.89,94.89 0 top
R1  0169-2013**Varistor 20mm 300V  [S20K40]  -110.77,19.31 270 top
R2  1200970587**RES 1206 470K %5 1/4W  [R1206_ENKO]  -119.64,36.33 90 top
R3  1200970587**RES 1206 470K %5 1/4W  [R1206_ENKO]  -119.64,41.31 270 top
R4  1200970587**RES 1206 470K %5 1/4W  [R1206_ENKO]  -119.64,46.28 90 top
R5  1200970687**RES 0603 56K %1 1/10W  [R0603_ENKO]  -62.68,98.48 90 top
R6  1200970583**RES 0603 1K %1 1/10W  [R0603_ENKO]  -57.41,97.83 0 top
R7  1029-4050**RES 1206 6K8 %1  [R1206_ENKO]  -67.16,101 270 top
R11  1200970154**RES 1206 2K2 %5 1/4W  [R1206_ENKO]  -52.04,111.49 0 top
R12  1200970154**RES 1206 2K2 %5 1/4W  [R1206_ENKO]  -57.03,111.5 180 top
R13  1200970601**RES 1206 10R %5 1/4W  [R1206_ENKO]  -65.16,71.28 0 top
R14  1029-6071**RES 0805 82R %1  [R0805_ENKO]  -54.59,103.99 0 top
R15  1029-3416**RES 0805 47R %1 (AbC) (MX322)  [R0805_ENKO]  -54.59,105.98 180 top
R16  1319-4060**Ferrite Bead SMD 0805 2kOhm@100MHz 300mA LAIRD HZ0805C202R-10  [R0805_ENKO]  -73.37,100.74 90 top
R17  1029-3146**RES 1206 7R68 %1  [R1206_ENKO]  -32.91,104.63 0 top
R18  1029-3146**RES 1206 7R68 %1  [R1206_ENKO]  -32.93,102.44 0 top
R19  NC**TAKILMAYACAK (Not Fitted)  [R1206_ENKO]  -65.86,85.81 90 top
R20  1319-4060**Ferrite Bead SMD 0805 2kOhm@100MHz 300mA LAIRD HZ0805C202R-10  [R0805_ENKO]  -63.72,87.26 270 top
R21  1200970568**RES 0603 47K %5 1/10W  [R0603_ENKO]  -23.56,111.08 180 top
R22  1319-4060**Ferrite Bead SMD 0805 2kOhm@100MHz 300mA LAIRD HZ0805C202R-10  [R0805_ENKO]  -62.27,50.46 90 top
R23  1029-3146**RES 1206 7R68 %1  [R1206_ENKO]  -32.93,100.3 0 top
R24  1029-3146**RES 1206 7R68 %1  [R1206_ENKO]  -32.93,98.18 0 top
R25  1200970228**RES 1206 47R %5 1/4W  [R1206_ENKO]  -10.95,63.59 90 top
R26  1200970228**RES 1206 47R %5 1/4W  [R1206_ENKO]  -13.36,63.59 90 top
R27  1029-6109**RES 2512 33R %5 1W  [R2512]  -4.25,103.81 270 top
R28  1200970587**RES 1206 470K %5 1/4W  [R1206_ENKO]  -75.71,111.23 180 top
R29  1200970587**RES 1206 470K %5 1/4W  [R1206_ENKO]  -70.75,111.25 180 top
R30  1029-6114**RES 2512 15R %5 1W  [R2512]  -4.24,96.07 270 top
R31  1029-6114**RES 2512 15R %5 1W  [R2512]  -10.45,95.36 0 top
R32  1200970587**RES 1206 470K %5 1/4W  [R1206_ENKO]  -65.78,111.27 180 top
R33  1029-6114**RES 2512 15R %5 1W  [R2512]  -8.57,89.22 90 top
R34  1029-6114**RES 2512 15R %5 1W  [R2512]  -4.25,88.35 270 top
R35  1029-3116**RES 0805 10R %5  [R0805_ENKO]  -68.7,46.32 0 top
R36  1200970117**RES 1206 0R %5  [R1206_ENKO]  -37.95,45.41 180 top
R37  1029-2228**RES 0603 330K %1  [R0603_ENKO]  -76.73,97.33 90 top
R38  1200970568**RES 0603 47K %5 1/10W  [R0603_ENKO]  -41.93,45.8 180 top
R39  NC**TAKILMAYACAK (Not Fitted)  [R1206_ENKO]  -7.26,61.95 0 top
R40  1200970554**RES 1206 56R %1 1/4W  [R1206_ENKO]  -7.26,59.87 0 top
R41  1200970554**RES 1206 56R %1 1/4W  [R1206_ENKO]  -7.26,57.78 0 top
R42  1200970554**RES 1206 56R %1 1/4W  [R1206_ENKO]  -7.26,55.64 0 top
R43  1200970554**RES 1206 56R %1 1/4W  [R1206_ENKO]  -7.3,53.48 0 top
R44  1200970568**RES 0603 47K %5 1/10W  [R0603_ENKO]  -37.46,41.1 270 top
R45  1319-4060**Ferrite Bead SMD 0805 2kOhm@100MHz 300mA LAIRD HZ0805C202R-10  [R0805_ENKO]  -59.38,20.95 270 top
R46  1200970518**RES 0603 10K %5 1/10W  [R0603_ENKO]  -68.12,18.15 180 top
R47  1200971020**RES 0603 10K %1 1/10W  [R0603_ENKO]  -39.05,41.65 270 top
R48  1200970516**RES 0603 22K %5 1/10W  [R0603_ENKO]  -40.64,41.65 270 top
R49  1029-2005**RES 0603 220R %1  [R0603_ENKO]  -79.88,8.02 270 top
R50  1200970803**RES 0603 100K %1 1/10W  [R0603_ENKO]  -11.05,3.11 270 top
R51  1200971020**RES 0603 10K %1 1/10W  [R0603_ENKO]  -9.29,3.15 90 top
R52  1029-2005**RES 0603 220R %1  [R0603_ENKO]  -81.47,8.01 270 top
R53  1029-2005**RES 0603 220R %1  [R0603_ENKO]  -83.05,8 270 top
R54  1200971020**RES 0603 10K %1 1/10W  [R0603_ENKO]  -46.53,38.9 180 top
R55  1200970153**RES 0805 2K2 %5 1/8W  [R0805_ENKO]  -44.83,41.66 180 top
R56  1200970522**RES 0603 1K %5 1/10W  [R0603_ENKO]  -72.2,25.48 90 top
R57  1200970803**RES 0603 100K %1 1/10W  [R0603_ENKO]  -4.91,3.15 270 top
R58  1200970770**RES 0603 4K3 %1 1/10W  [R0603_ENKO]  -7.71,3.15 90 top
R59  1200970803**RES 0603 100K %1 1/10W  [R0603_ENKO]  -44.23,38.1 270 top
R60  1200970583**RES 0603 1K %1 1/10W  [R0603_ENKO]  -38.06,38.8 0 top
R61  1200970583**RES 0603 1K %1 1/10W  [R0603_ENKO]  -46.51,37.41 180 top
R62  1200970706**RES 0603 1K8 %5 1/10W  [R0603_ENKO]  -41.48,35.36 0 top
R63  1029-2003**RES 0603 10R %1  [R0603_ENKO]  -40.38,33.07 270 top
R64  1029-2006**RES 0603 47R %1  [R0603_ENKO]  -38.79,33.08 90 top
R65  1029-6021**RES 2512 0R003 %1 2W  [R2512]  -31.86,21.72 270 top
R66  1200970927**RES 0603 100R %1 1/10W  [R0603_ENKO]  -40.23,30.78 0 top
R67  1200970522**RES 0603 1K %5 1/10W  [R0603_ENKO]  -39.34,24.01 0 top
R68  1200970522**RES 0603 1K %5 1/10W  [R0603_ENKO]  -36.34,23.17 180 top
R69  1029-2003**RES 0603 10R %1  [R0603_ENKO]  -52.07,32.34 0 top
R70  1200971020**RES 0603 10K %1 1/10W  [R0603_ENKO]  -43.19,30.78 0 top
R71  1029-2234**RES 0603 4K7 %1  [R0603_ENKO]  -36.33,24.79 0 top
R72  1200970583**RES 0603 1K %1 1/10W  [R0603_ENKO]  -70.43,34.18 0 top
R73  1169-1001**TSM2A103F3951RZ THINKING 0805 10K NTC 125C  [R0805_ENKO]  -71.91,36.23 180 top
R74  1200970156**RES 1206 22K %5 1/4W  [R1206_ENKO]  -70.48,49.86 90 top
R75  1200970583**RES 0603 1K %1 1/10W  [R0603_ENKO]  -48.03,25.33 90 top
R76  1200970803**RES 0603 100K %1 1/10W  [R0603_ENKO]  -52.81,36.59 90 top
R77  1029-6089**RES 0603 6K8 %5  [R0603_ENKO]  -48.02,28.3 90 top
R78  1029-2203**RES 0603 12K %1  [R0603_ENKO]  -48.16,40.52 0 top
R79  1029-2341**RES 0603 5K6 %1  [R0603_ENKO]  -48.82,38.01 90 top
R80  1029-2234**RES 0603 4K7 %1  [R0603_ENKO]  -51.2,36.59 90 top
R81  1200970583**RES 0603 1K %1 1/10W  [R0603_ENKO]  -50.43,39.84 270 top
R82  1200971020**RES 0603 10K %1 1/10W  [R0603_ENKO]  -51.49,44.15 90 top
R83  1200970522**RES 0603 1K %5 1/10W  [R0603_ENKO]  -49.63,28.3 270 top
R84  1200970522**RES 0603 1K %5 1/10W  [R0603_ENKO]  -52.64,38.88 0 top
R85  1169-1006**FUSE SMD 1206 PTC RESETTABLE 16V IHOLD=0.75A IMAX=100A  [R1206_ENKO]  -62.93,15.76 270 top
R86  1200970522**RES 0603 1K %5 1/10W  [R0603_ENKO]  -3.63,30.43 0 top
R87  1200970518**RES 0603 10K %5 1/10W  [R0603_ENKO]  -3.63,35.56 0 top
R88  1029-2234**RES 0603 4K7 %1  [R0603_ENKO]  -58.76,12.94 0 top
R89  1200970583**RES 0603 1K %1 1/10W  [R0603_ENKO]  -58.65,7.96 180 top
R90  1029-2231**RES 0603 1K8 %1  [R0603_ENKO]  -57.75,5.67 90 top
R91  1200970518**RES 0603 10K %5 1/10W  [R0603_ENKO]  -47.88,19.05 0 top
R92  1200970568**RES 0603 47K %5 1/10W  [R0603_ENKO]  -45.48,17.46 270 top
R93  1409-0025**RES 0603 470R %5 1/16W  [R0603_ENKO]  -46.07,15.12 180 top
R94  1029-6086**RES 0603 22R %1  [R0603_ENKO]  -47.41,9.79 90 top
R95  1200970522**RES 0603 1K %5 1/10W  [R0603_ENKO]  -73.41,34.37 0 top
R96  1029-6086**RES 0603 22R %1  [R0603_ENKO]  -74.2,13.76 180 top
R97  1029-6086**RES 0603 22R %1  [R0603_ENKO]  -72.38,15.68 180 top
R98  1029-2234**RES 0603 4K7 %1  [R0603_ENKO]  -47.42,12.78 90 top
R99  1200970518**RES 0603 10K %5 1/10W  [R0603_ENKO]  -75.22,36.46 0 top
R100  1200970852**RES 0603 1K5 %5 1/10W ( <-1029-3501 )  [R0603_ENKO]  -76.48,13.05 270 top
R101  1200970684**RES 0603 47K %1 1/10W  [R0603_ENKO]  -49.05,13.65 270 top
R102  1200970583**RES 0603 1K %1 1/10W  [R0603_ENKO]  -51.18,15.76 270 top
R103  1200970522**RES 0603 1K %5 1/10W  [R0603_ENKO]  -83.71,43.33 90 top
R104  1200970522**RES 0603 1K %5 1/10W  [R0603_ENKO]  -81.35,35.96 90 top
R105  1029-2229**RES 0603 120K %1  [R0603_ENKO]  -52.62,12.97 180 top
R106  1029-2219**RES 0603 30K %1  [R0603_ENKO]  -52.77,15.74 90 top
R107  1200970515**RES 0603 100K %5 1/10W  [R0603_ENKO]  -39.69,11.17 180 top
R108  1200970730**RES 0603 560R %1 1/10W  [R0603_ENKO]  -55.77,12.94 180 top
R109  1200970518**RES 0603 10K %5 1/10W  [R0603_ENKO]  -42.05,16.11 90 top
R110  1200970516**RES 0603 22K %5 1/10W  [R0603_ENKO]  -43.18,18.44 180 top
R111  1029-2341**RES 0603 5K6 %1  [R0603_ENKO]  -80.59,93.37 180 top
R112  1200970154**RES 1206 2K2 %5 1/4W  [R1206_ENKO]  -38.7,9.29 180 top
R113  1200970121**RES 0805 1K %5 1/8W  [R0805_ENKO]  -35.87,20.3 180 top
R114  1200970518**RES 0603 10K %5 1/10W  [R0603_ENKO]  -35.51,18.46 180 top
R115  1200970853**RES 1206 39K %1 1/4W  [R1206_ENKO]  -34.99,11.83 0 top
R116  1200970585**RES 0603 1M %5 1/10W  [R0603_ENKO]  -29.39,15.19 270 top
R117  1029-6015**RES 1206 56K %5  [R1206_ENKO]  -35.77,5.47 90 top
R118  1029-6106**RES 2512 270mR %1 2W [ARGE?]  [R2512]  -14.08,103.57 90 top
R119  1029-6106**RES 2512 270mR %1 2W [ARGE?]  [R2512]  -10.03,103.55 90 top
R120  1029-2335**RES 0603 33K %1  [R0603_ENKO]  -87.46,92.83 0 top
R121  1029-2005**RES 0603 220R %1  [R0603_ENKO]  -83.97,93.3 0 top
R122  NC**Takılmayacak  [R1206_ENKO]  -97.91,101.29 180 top
R123  NC**Takılmayacak  [R1206_ENKO]  -97.89,106.1 180 top
R124  NC**Takılmayacak  [R1206_ENKO]  -97.92,103.74 180 top
R125  1200970627**RES 0603 100R %5 1/10W  [R0603_ENKO]  -79.94,101.75 270 top
R126  1200971020**RES 0603 10K %1 1/10W  [R0603_ENKO]  -78.35,101.73 270 top
R131  1029-2336**RES 0603 68K %1  [R0603_ENKO]  -92.61,85.69 270 top
R132  1200970934**RES 0603 470K %1 1/10W  [R0603_ENKO]  -90.44,92.82 0 top
R133  1200970626**RES 0603 82K %1 1/10W  [R0603_ENKO]  -67.28,40.72 90 top
R134  1029-2234**RES 0603 4K7 %1  [R0603_ENKO]  -72.55,39.66 0 top
R135  1200970940**RES 0603 6K8 %1 1/10W  [R0603_ENKO]  -75.76,38.97 90 top
R136  1029-2335**RES 0603 33K %1  [R0603_ENKO]  -93.42,92.2 0 top
R137  1200970528**RES 0603 0R %5 1/10W  [R0603_ENKO]  -90.25,91.23 0 top
R138  1200970569**RES 0603 33K %5 1/10W  [R0603_ENKO]  -89.75,95.09 90 top
R139  1200970158**RES 1206 220K %5 1/4W  [R1206]  -119.67,77.72 90 top
R140  1200970158**RES 1206 220K %5 1/4W  [R1206]  -119.66,82.72 90 top
R142  1029-6021**RES 2512 0R003 %1 2W  [R2512]  -83.03,64.72 0 top
R143  1200970158**RES 1206 220K %5 1/4W  [R1206]  -119.64,72.67 90 top
R144  1200970584**RES 0603 18K %1 1/10W  [R0603_ENKO]  -75.91,102.62 0 top
R193  1200970934**RES 0603 470K %1 1/10W  [R0603_ENKO]  -72.55,41.17 0 top
R194  1200970528**RES 0603 0R %5 1/10W  [R0603_ENKO]  -80.05,42.55 270 top
RL1  1200930051**RELAY SPST 12V 5A 7x15x20.3mm  [ALD1_AND_ALJ_RELAY]  -5.99,16.33 270 top
STENCIL  041-7516**SDA381V2 için Çerçeveli Elek (Stencil) (600x600)  [PCB]  -153.49,102.09 0 top
T1  1109-1016**Transistor NPN 3A 100V 15W Hfemin:10 DPAK Diodes MJD31C-13  [DPAK]  -58.73,74.24 180 top
T2  1109-4205**Mosfet N-Ch 220mA 50V Rds:1.16R SOT-23 INFINEON BSS138  [SOT-23]  -93.23,89.49 180 top
T3  1200980091**TRANS SMD PNP BC857B SOT-23  [SOT23-BEC]  -41.42,38.52 270 top
T4  1200980090**TRANS SMD NPN BC847B SOT-23  [SOT23]  -48.77,42.98 270 top
T5  1200980090**TRANS SMD NPN BC847B SOT-23  [SOT23]  -4.11,32.91 90 top
T6  1200980090**TRANS SMD NPN BC847B SOT-23  [SOT23]  -78.61,35.92 90 top
T7  1200980090**TRANS SMD NPN BC847B SOT-23  [SOT23]  -38.37,14.46 270 top
T8  1109-4205**Mosfet N-Ch 220mA 50V Rds:1.16R SOT-23 INFINEON BSS138  [SOT-23]  -70.36,99.59 270 top
T9  1200980090**TRANS SMD NPN BC847B SOT-23  [SOT23]  -35.77,15.82 180 top
T10  1049-1012**MMBTA56 PNP 80V 500mA 330mW hfe(min):100 SOT23  [SOT23-BEC]  -31.04,12.13 0 top
TP4  PTR1TP20R  [TP20R]  -65.33,35.91 0 top
TRF1  0319-7452**SMPS TRAFO 150W E42/21/15 300uH DBC2 [ARGE?]  [DEIF_TRF]  -40.23,74.53 270 top
TVS1  1119-3061**5V 130W TVS Diode SOD-323  [SOD323]  -65.22,15.59 90 top
U1  1039-2220**STM32F072C8T6 64K Flash USB, CAN  [STM32F072CXXX_LQFP48]  -65.24,29.6 0 top
U2  1039-2392**LMR16006XDDCR 0.6A, 0.7MHz Step-Down Converter in a TSOT-6L, Input 4V to 60V  [AOZ1282CI-1]  -76.25,41.9 0 top
U3  1039-2420***PFC Controller CCM Mode Texas Instruments UCC28180  [UCC28180]  -81.89,96.95 270 top
U4  Stok Dışı -  [0077930A7]  -108.06,81.64 90 top
U$1  [SERI_NO_ETIKET_ALANI]  -40.34,73.95 180 bottom
U$2  [EN-KO_AMLEMI]  -84.36,13.66 0 top
U$3  [EN-KO_AMLEMI]  -83.05,62.41 0 bottom
U$4  [ROHS]  -68.12,73.97 0 bottom
U$5  [FT-ICT]  -57.01,73.88 0 bottom
X1  0289-1462**GMSTBA 2.5/ 3-G-7.62 (Phoenix 1766246)  [GMSTBA3]  -99.6,0.91 0 top
X2  0309-1064**USB Type-B Mini Connector Horizantal  [USB_B(YATIK)]  -68,5 90 top
X3  0289-1460**MSTBA 2.5/ 4-G-5.08 (Phoenix 1757268)  [MSTBA4]  -23.18,0.91 0 top
X4  0289-1464**MSTBA 2.5/ 3-G-5.08 (Phoenix 1757255)  [MSTBA3]  -48.13,0.91 0 top
XK1  0289-1463**GMVSTBR 2.5/ 3-ST-7.62 (Phoenix 1832536)  [SOKET]  -153.47,106.87 0 top
XK3  0289-1461**MVSTBR 2.5/ 4-ST-5.08 (Phoenix 1792265)  [SOKET]  -153.47,106.13 0 top
XK4  0289-1465**MVSTBR 2.5/ 3-ST-5.08 (Phoenix 1792252)  [SOKET]  -153.49,105.3 0 top
Y1  NX2016SA-32M  [NX2016SA-32M]  -64.96,20.77 0 top
Z1  1129-1195**ZENER SOT23 18V 400mW %5 BZX84C18V  [SOT23]  -70.39,102.81 270 top
Z2  NC**TAKILMAYACAK (Not Fitted)  [SOT23]  -64.23,103.19 0 top
Z3  1129-1152**ZENER SOT23 10V 0.4W BZX84-C10  [SOT23]  -95.04,85.58 180 top
Z4  1129-1162**ZENER SOT23 3V9 300mW BZX84C3V9  [SOT23]  -48.5,16.64 270 top
Z5  1129-1145**ZENER SOT23 0.3W 15V BZX84C15  [SOT23]  -83.01,50.41 0 top
Z6  1129-1145**ZENER SOT23 0.3W 15V BZX84C15  [SOT23]  -80.27,38.98 90 top
Z7  1129-1151**ZENER SOT23 12V 225mW BZX84C12  [SOT23]  -39.35,19.97 180 top
Z8  1129-1140**ZENER SOT23 5V1 0.4W BZX84C5V1  [SOT23]  -32.59,15.82 180 top

## Tracks (layer width: path | path; a pad name or v marks a point on that pad's centre or on a via)
13.8V+  (via drill 0.35)
  Top 0.254: R78.2 -47.36,40.84 -47.35,40.85
  Top 0.305: -12.49,2.81 -12.17,2.81 -11.08,3.9 R50.1 | -12.49,2.81 -12.89,2.81 | -12.89,2.81 -13.19,2.81 | -13.19,2.81 -33.85,2.81 | R117.1 -35.03,3.99 -33.85,2.81 | -12.49,2.81 -11.3,4 -11.3,4.4 | -12.89,2.81 -11.3,4.4 | -11.3,4.4 -11.3,4.6 | -13.19,2.81 -11.05,4.95 C72.2 | -33.85,2.81 -34.12,2.81 | -35.29,3.98 -34.12,2.81 | -34.12,2.81 -34.39,2.81 | -34.39,2.81 -35.37,3.79 | -34.39,2.81 -34.7,2.81 | -34.7,2.81 -35.58,3.69 | -34.7,2.81 -35.01,2.81 | -35.84,3.64 -35.01,2.81 | -35.01,2.81 -35.34,2.81 | -36.21,3.68 -35.34,2.81 | -35.34,2.81 -35.69,2.81 | -35.69,2.81 -36.51,3.63 | -35.69,2.81 -35.88,2.81 | -35.88,2.81 -36.94,3.87 | -35.88,2.81 -36.3,2.81 | -37.48,3.99 -36.3,2.81 | -36.3,2.81 -36.65,2.81 | -36.65,2.81 -37.83,3.99 | -36.65,2.81 -36.93,2.81 | -38.11,3.99 -36.93,2.81 | -36.93,2.81 -37.24,2.81 | -37.24,2.81 -38.42,3.99 | -37.24,2.81 -37.41,2.81 | -37.41,2.81 -38.59,3.99 | -37.41,2.81 -37.55,2.81 -38.7,3.96 | v-45.17,43.09 -44.92,42.84 -44.92,42.5 | -44.92,42.5 -44.92,40.73 -45.17,40.48 -46.47,40.48 | -46.47,40.48 -46.64,40.48 | -45.63,43.55 C37.1 -45.63,44.16 -45.94,43.85 -45.63,43.55 | -45.63,43.55 -45.62,43.55 | -45.62,43.55 v-45.17,43.09 | R78.2 -47.31,40.48 -46.72,40.48 -47.05,40.13 | TRF1.43 -42.73,56.87 -43.14,56.46 | TRF1.43 -42.73,56.91 -43.13,56.51 | TRF1.43 -42.73,57.19 -42.07,56.53 | TRF1.43 -42.73,56.93 -43.07,56.59 | -46.47,40.48 -46.48,40.48 -46.56,40.48 -46.93,40.85 -47.35,40.85 | -45.4,43.69 -45.4,44.22 -45.45,44.27 | -45.4,43.69 -45.4,43.32 v-45.17,43.09 | -74.48,53.95 -74.69,53.74 | -74.69,53.74 -75.46,52.97 -75.46,52.64 -74.63,53.47 | -74.15,53.95 -74.63,53.47 | -44.92,42.5 -44.92,42.58 | -44.92,42.58 -44.94,43.1 v-45.17,43.09
  Top 0.305: -44.92,42.58 -45.29,42.97 v-45.17,43.09 | -45.62,43.55 -45.38,43 v-45.17,43.09 | -45.62,43.55 -45.08,43.3 v-45.17,43.09 | -45.4,43.69 -45.4,43.09 v-45.17,43.09 | -45.4,43.69 -45,43.24 v-45.17,43.09 | -74.69,53.74 -75.74,54.08 | -74.69,53.74 -75.31,52.82 | -74.63,53.47 -75.59,54.01 | -74.63,53.47 -75.41,52.69
  Top 0.406: D7.A -59.66,50.94 | C72.2 R50.1
  Top 0.508: -40.69,55.92 -40.96,55.92 | -43.19,57.33 -43.92,56.59 -43.92,56.3 -43.46,55.84 | -43.19,57.33 TRF1.43 | -43.03,57.17 -43.19,57.33 | TRF1.22 -42.69,56.76 -42.26,56.32 -42.13,56.32 | -38.88,56.63 -39.36,56.15 -39.68,56.15 | -38.88,56.63 -38.06,57.45 | -38.06,57.45 TRF1.44 -37.18,57.24 -37.18,56.65 | -40.65,56.15 -40.26,56.15 | -40.26,56.15 -40.19,56.15 | -40.19,56.15 -39.68,56.15 | -39.73,56.63 -38.88,56.63 | -39.93,55.85 -39.39,55.85 | -39.39,55.85 -38.82,55.85 -38.39,56.28 | -38.39,56.28 -38.06,56.6 -38.06,57.16 -38.06,57.45 | -39.06,56.28 -38.39,56.28 | -38.09,56.79 TRF1.21 -37.73,56.69 | -40.56,56.44 -42.78,56.54 -40.56,56.44 | C37.1 -45.63,44.13 | R117.1 -37.48,3.99 -37.83,3.99 -38.11,3.99 -38.42,3.99 -38.59,3.99 -39.08,4.48 -39.08,6.82 | -39.08,6.82 v-39.08,7.46 | -40.19,56.15 -39.52,55.97 | -39.52,55.97 -38.04,55.59 -40.19,56.15 | -40.19,56.15 -39.89,56.44 | -39.89,56.44 -38.59,57.69 -40.19,56.15 | -39.08,6.82 -38.96,7.44 v-39.08,7.46 | -39.08,6.82 -39.2,7.44 v-39.08,7.46 | -40.26,56.15 -40.56,56.44 | -40.56,56.44 -41.86,57.69 | -40.26,56.15 -42.41,55.59 | -40.93,55.97 -41.52,58.12 -40.93,55.97 | -40.56,56.44 -41.63,58.39 | -40.93,55.97 -43.07,56.59 | -39.68,56.15 -37.5,56.56 | -39.68,56.15 -38.89,58.23 | -39.39,55.85 -37.3,56.62 | -39.39,55.85 -38.95,58.03 | -39.52,55.97 -37.38,56.59 | -39.52,55.97 -38.93,58.12 | -39.89,56.44 -37.67,56.54 | -39.89,56.44 -38.82,58.39
  Top 0.61: -46.19,53.33 -57.46,53.33 | -46.19,53.33 -44.53,54.99 | -44.53,54.99 | -44.53,54.99 -43.96,55.55 | -43.96,55.55 TRF1.22 | -46.19,53.33 -45.49,53.33 | -42.86,55.96 -43.47,55.35 | -43.47,55.35 -44.15,54.67 | -44.15,54.67 -45.49,53.33 | -45.49,53.33 -44.72,53.33 | -44.72,53.33 -43.64,54.41 | -43.64,54.41 -42.81,55.24 | -42.81,55.24 -42.3,55.75 | -44.72,53.33 -44.4,53.33 | -44.4,53.33 -43.4,54.33 | -43.4,54.33 -42.48,55.25 | -42.48,55.25 -41.24,56.49 -41.51,56.76 -42.69,56.76 | -44.4,53.33 -43.55,53.33 | -40.96,55.92 -42.64,54.24 | -42.64,54.24 -43.55,53.33 | -43.55,53.33 -43.28,53.33 | -43.28,53.33 -42.34,54.27 | -42.34,54.27 -40.69,55.92 | -43.28,53.33 -42.45,53.33 -40.05,55.73 | -40.05,55.73 -39.93,55.85 | -44.53,54.99 | -43.41,55.33 -42.38,55.65 -43.41,55.33 | -44.53,54.99 -44.29,55.77 | -44.29,55.77 -43.87,57.14 -44.29,55.77 | -43.64,54.41 -42.69,55.23 | -43.89,57.53 | -42.69,55.23 | -42.69,55.23 | -42.69,55.23 -43.77,57.21 | -43.85,57.37 | -43.64,54.41 -42.69,55.23 | -42.69,55.23 -41.94,55.89 -42.69,55.23 | -43.06,55.26 -41.75,57.09 | -42.69,55.23 | -42.54,55.24 -41.63,57.3 | -43.77,57.21 | -44.53,54.99 | -44.15,54.67 -43.06,55.26 | -43.06,55.26 | -43.06,55.26 | -43.06,55.26 -42.16,55.74 -43.06,55.26 | -43.4,54.33 -42.54,55.24 | -42.54,55.24 -41.85,55.97 | -43.06,55.26 | -43.06,55.26 -41.75,57.09 | -43.06,55.26 | -42.12,55.31 -43.14,56.46 -43.62,56.99 -42.12,55.31 | -41.96,55.35 -43.13,56.51 -43.56,56.93 -41.96,55.35 | -42.81,55.24 -42.07,56.53 -41.69,57.19 -42.81,55.24 | -40.05,55.73 -39.16,55.68 | -39.16,55.68 | -39.16,55.68 -37.8,55.6 | -40.05,55.73 -39.7,56.18 | -39.7,56.18 -38.67,57.52 | -40.05,55.73 -39.16,55.68 | -39.16,55.68 -37.8,55.6 | -40.05,55.73 -39.7,56.18
  Top 0.61: -39.7,56.18 -38.67,57.52 | C74.1 -76,53.44 -75.49,53.95 -74.48,53.95 -74.46,53.95 | -74.46,53.95 -74.15,53.95 -72.37,53.95 | -57.46,53.33 -59.66,51.13 D7.A | -72.37,53.95 -71.27,53.95 -71.08,54.15 -71.08,54.64 -71.23,54.8 OC2.1 | -72.37,53.95 OC2.1 | OC2.1 -72.02,54.8 -72.79,54.03 | -57.46,53.33 -57.91,53.33 | -59.93,51.31 -57.91,53.33 | -57.91,53.33 -58.4,53.33 | -58.4,53.33 -60.27,51.46 | -58.4,53.33 -58.65,53.33 -60.49,51.49 | -74.46,53.95 -76,53.97 | -74.46,53.95 -75.5,52.82 | -44.53,54.99 -43.41,55.33 | -44.53,54.99 -44.29,55.77 | -44.53,54.99 -43.41,55.33 | -44.53,54.99 -44.29,55.77 | -44.15,54.67 -43.06,55.26 | -43.06,55.26 | -44.15,54.67 -44.05,55.61 | -44.05,55.61 -43.91,56.91 | -43.64,54.41 -42.69,55.23 | -43.64,54.41 -43.77,55.46 | -43.77,55.46 -43.91,56.65 | -43.4,54.33 -42.54,55.24 | -42.54,55.24 -41.85,55.97 | -43.4,54.33 | -43.64,55.41 -43.89,56.53 -43.64,55.41 | -43.4,54.33 -42.54,55.24 | -42.54,55.24 -41.85,55.97 | -43.4,54.33 -43.64,55.41 | -42.64,54.24 -41.65,56.27 | -42.64,54.24 -43.24,55.29 | -43.24,55.29 -43.76,56.19 | -42.34,54.27 -41.96,55.35 | -41.96,55.35 -41.6,56.4 | -42.34,54.27 -43.07,55.26 | -43.07,55.26 -43.68,56.08 | -43.06,55.26 -41.75,57.09 | -41.75,57.09 | -43.06,55.26 -43.84,57.37 | -42.12,55.31 -43.62,56.99 | -42.69,55.23 -43.77,57.21 | -43.77,57.21 | -43.06,55.26 -41.75,57.09 | -43.06,55.26 -43.84,57.37 | -43.84,57.37 | -42.54,55.24 -41.63,57.3 | -42.54,55.24 -43.74,57.15 -42.54,55.24 | -43.41,55.33 -41.86,56.96 | -43.41,55.33 -43.89,57.53 | -44.29,55.77 -42.23,56.7 | -44.29,55.77 -43.9,57.99 | -43.06,55.26 -41.75,57.09 | -43.06,55.26 | -43.06,55.26 -43.84,57.37 | -43.06,55.26 -41.75,57.09 | -43.06,55.26 -43.84,57.37
  Top 0.61: -44.05,55.61 -42.11,56.76 | -44.05,55.61 -43.92,57.85 | -42.69,55.23 -41.66,57.24 | -41.66,57.24 | -42.69,55.23 -43.77,57.21 | -42.69,55.23 -41.66,57.24 | -42.69,55.23 -43.77,57.21 | -43.77,55.46 -41.99,56.84 | -43.77,55.46 -43.92,57.7 | -42.54,55.24 -41.63,57.3 | -43.64,55.41 -41.94,56.88 | -43.64,55.41 -43.91,57.64 | -42.12,55.31 -41.57,57.49 | -43.24,55.29 -41.8,57.02 | -43.24,55.29 -43.87,57.45 | -41.96,55.35 -41.55,57.57 | -43.07,55.26 -41.76,57.09 | -43.07,55.26 -43.85,57.37 | -43.96,55.55 -42.07,56.78 | -43.96,55.55 -43.92,57.81 | -43.47,55.35 -41.88,56.94 | -43.47,55.35 -43.9,57.56 | -42.81,55.24 -43.8,57.26 | -42.48,55.25 -41.62,57.33 | -42.48,55.25 -43.72,57.13 | -39.16,55.68 -38.91,57.92 | -38.91,57.92 | -39.16,55.68 -38.91,57.92 | -39.7,56.18 | -39.16,55.68 | -39.16,55.68 -38.91,57.92 | -39.16,55.68 -37.17,56.73 | -37.17,56.73 | -39.16,55.68 -38.91,57.92 | -39.7,56.18 -38.83,58.25 | -39.16,55.68 -38.91,57.92 | -39.7,56.18 -37.49,56.61 | -39.7,56.18 -38.83,58.25 | -39.16,55.68 -38.91,57.92 | -38.91,57.92 -39.16,55.68 | -39.7,56.18 -38.83,58.25 | -39.16,55.68 -37.17,56.73 | -39.16,55.68 -38.91,57.92 | -39.7,56.18 -37.49,56.61 | -37.49,56.61 | -39.7,56.18 | -39.16,55.68 -37.17,56.73 | -39.7,56.18 -37.49,56.61 | -39.7,56.18 -38.83,58.25 | -40.05,55.73 -37.8,55.6 | -37.8,55.6 | -40.05,55.73 -38.67,57.52 | -40.05,55.73 -37.8,55.6 | -40.05,55.73 -38.67,57.52
  Top 0.813: C36.1 -45.69,44.35 C37.1 | C72.2 -11.05,3.93 -11.08,3.9
  Top 2.54: TRF1.43 -38.41,57.78 -38.06,57.45 | TRF1.22 -42.54,56.6 -38.06,56.6 | TRF1.21 -38.06,57.13 -38.06,57.16
  Bottom 0.508: v-39.08,7.46 -38.76,7.78 -38.76,8.02 | -25.44,22.73 -25.44,22.45 -24.77,23.12 | -25.44,22.73 -25.44,23.92 | -25.44,23.92 -24.6,24.76 L6.1 | -38.76,8.02 -38.76,20.53 -37.93,21.36 -26.81,21.36 -25.73,22.44 | -25.73,22.44 -25.44,22.73 | -25.73,22.44 -24.19,22.44 -23.78,22.85 | -23.78,22.85 -23.48,23.15 -23.48,24.01 | C42.+ -34.71,32.63 -34.81,32.73 | v-45.17,43.09 -44.72,42.63 | -44.72,42.63 -34.81,32.73 | -44.72,42.63 -45.07,43.16 v-45.17,43.09 | -44.72,42.63 -45.24,42.99 v-45.17,43.09 | -38.76,8.02 -39.17,7.54 v-39.08,7.46 | -38.76,8.02 -38.96,7.42 v-39.08,7.46 | -34.81,32.73 -33.66,31.83 | -34.81,32.73 -33.56,33.49 | -25.44,23.92 -23.74,23.89 | -25.44,23.92 -24.42,25.28 | -23.78,22.85 -22.96,24.34 | -23.78,22.85 -24.51,24.39
  Bottom 1.27: -16.52,68.39 -17.78,67.13 -17.78,65.43 | -14.82,68.39 -17.78,65.43 | -13.71,68.39 -16.67,65.43 -17.78,65.43
  Bottom 1.5: -10.47,68.39 C73.1 -7.21,69.36 C18.P$1 -6.16,69.27 -7.04,68.39 -10.47,68.39 | -13.35,68.39 -13.71,68.39 -14.82,68.39 -16.52,68.39 -17.78,69.65 C24.P$1 | -10.47,68.39 -12.12,68.39 | -17.78,63.96 -13.35,68.39 | -13.35,68.39 -12.12,68.39 | -12.12,68.39 -18.91,61.6
  Bottom 2: C74.1 -73.31,53.28 -71.73,54.85 -66.08,54.85 -59.77,61.17 -45.47,61.17 | -45.47,61.17 -42.73,58.43 TRF1.22 -42.66,56.79 -42.22,57.23 -42.22,60.79 -41.84,61.17 | -45.47,61.17 -41.84,61.17 | -41.84,61.17 -37.85,61.17 | -37.85,61.17 -36.36,61.17 | -36.36,61.17 -34.18,61.17 | -34.18,61.17 -20.57,61.17 | C24.P$1 -17.78,65.43 -17.78,63.96 -20.57,61.17 | TRF1.43 -40.14,60.37 -40.14,60.56 | -37.85,61.17 -37.85,60.2 -40.73,57.32 | -36.36,61.17 -36.36,58.16 TRF1.21 -37.73,57.63 -34.18,61.17 | -20.57,61.17 -19.34,61.17 -18.91,61.6 -12.82,67.69 -10.8,67.69 -9.51,68.98 C73.1
  pour Bottom (isolate 0.305, no thermals): -43.96,55.28 -45.36,53.88 -45.36,43.38 -24.29,22.31 -17.76,22.31 -16.07,24 -16.07,32.47 -23.89,40.29 -26.61,40.29 -27.73,41.41 -27.73,46.28 -34.88,53.43 -34.88,58.67 -35.29,59.08 -43.74,59.08 -43.96,58.86
+3V3  (via drill 0.35)
  Top 0.254: -76.66,12.26 R100.2
  Top 0.305: -69.08,37.07 C57.1 -69.36,37.59 | IC5.8 -40.18,29.27 -41.53,27.91 | -44.18,18.65 R110.2 -43.97,19.07 -44.18,19.28 | -44.18,18.65 -44.24,18.71 -44.24,19.34 | v-42.11,27.64 -41.81,27.64 -41.53,27.91 | v-49.35,20.29 -49.26,20.2 -48.81,20.2 | -48.72,20.2 -45.1,20.2 -44.24,19.34 | -48.72,20.2 -48.81,20.2 | -61.47,40.42 C54.1 | C38.1 | C38.1 -70.69,23.45 | -70.69,23.45 -70.69,23.85 -70.53,24.01 | -70.53,24.01 -70.36,24.18 | -70.36,24.18 -70.04,24.5 -70.04,24.72 | -70.04,26.3 -70.04,26.46 -69.65,26.85 U1.48 -70.04,26.3 | -70.04,26.3 -70.04,24.72 | -70.69,21.42 C39.1 -70.69,21.34 -71.21,20.82 | -71.21,20.82 -71.77,20.25 -71.77,19.11 | -72.11,16.98 -71.77,17.32 -71.77,17.49 | -71.77,19.11 -71.77,18.85 | -71.77,18.85 -71.77,18.56 | -71.77,18.56 -71.77,18.35 | -71.77,18.35 -71.77,18.12 | -71.77,18.12 -71.77,17.93 | -71.77,17.93 -71.77,17.74 | -71.77,17.74 -71.77,17.64 | -71.77,17.64 -71.77,17.49 | -66.86,17.85 -67.06,18.05 -67.16,18.15 R46.1 -67.33,17.84 -68.18,16.98 | U1.24 -60.2,32.35 | -60.2,32.35 -60.14,32.35 -59.92,32.56 | -59.92,32.56 -59.72,32.77 | -59.72,32.77 -59.47,33.02 | -59.47,33.02 -59.17,33.32 -58.87,33.32 C48.1 -58.64,33.41 | -68.73,33.85 -68.86,33.85 | -68.86,33.85 -69.37,34.36 -69.37,34.49 -68.97,34.08 | C55.1 -69.07,35.46 | -69.62,34.2 R72.2 -69.31,33.85 -68.86,33.85 | -44.24,19.34 -44.18,19.28 | -44.18,19.28 -44.18,18.65 | -70.04,24.72 -71,23.76 | -70.69,23.45 -71,23.76 | -71,23.76 -71,23.07 -70.69,22.76 | -70.53,24.01 -70.53,23.14 | -70.53,23.14 C38.1 | -70.36,24.18 -70.36,24.14 -70.37,24.13 -70.37,23.3 -70.53,23.14 | -59.39,34.03 -59.47,33.95 -59.47,33.02 | -59.72,32.77 -59.72,34.35 -59.78,34.42 | -59.92,32.56 -59.92,34.56 -60.11,34.75 -60.2,34.66 -60.2,33.14
  Top 0.305: -60.2,32.35 -60.2,32.79 | -60.2,32.79 -60.2,33.14 | U1.24 -60.64,32.35 -60.2,32.79 | U1.24 -60.35,32.99 | -60.35,32.99 -60.2,33.14 | -60.35,32.99 -60.35,34.98 -60.45,35.08 | -58.51,33.87 -57.89,33.87 | -57.89,33.87 -57.73,33.87 | -57.73,33.87 -57.45,33.87 | -57.45,33.87 -57.06,33.87 | -57.34,33.98 -57.45,33.87 | -57.37,34.35 -57.15,34.35 -57.06,34.26 -57.34,33.98 | -57.37,34.35 -57.62,34.35 | -57.62,34.35 -57.91,34.35 | -57.91,34.35 -58.3,34.35 | -58.3,34.35 -58.45,34.35 | -58.45,34.35 -58.99,34.35 | -58.78,34.14 -58.51,33.87 | -58.3,34.28 -58.3,34.08 -58.4,33.99 | -58.4,33.99 -58.51,33.87 | -58.45,34.35 -58.45,34.04 -58.4,33.99 | -58.3,34.35 -58.3,34.28 | -58.3,34.28 -57.89,33.87 | -57.91,34.35 -57.91,34.19 | -57.73,33.87 -57.91,34.05 -57.91,34.19 | -57.62,34.35 -57.62,34.12 | -57.62,34.12 -57.62,33.98 | -57.62,33.98 -57.73,33.87 | -57.34,33.98 -57.62,33.98 | -57.37,34.35 -57.6,34.12 -57.62,34.12 | -57.37,34.35 -57.37,34.48 | -57.37,34.48 -57.37,34.73 | -57.37,34.73 v-57.06,35.04 | -57.37,34.73 -57.51,34.59 | -57.51,34.59 -57.91,34.19 | -68.73,33.85 U1.36 -68.22,34.08 -68.58,34.08 | -68.73,33.85 -68.97,34.08 | -68.58,34.08 -68.97,34.08 | -68.58,34.08 -69.37,34.88 | -71.77,17.74 -71.01,16.98 -70.84,16.98 -70.84,17 -71.77,17.93 | -71.77,17.49 -71.46,17.18 -71.46,16.98 | -71.77,17.64 -72.43,16.98 -72.46,16.98 | -71.77,18.12 -70.63,16.98 -70.47,16.98 | -71.77,18.35 -70.4,16.98 -70.24,16.98 | -71.77,18.56 -70.19,16.98 -69.98,16.98 | -71.77,18.85 -69.9,16.98 -69.73,16.98 | -71.77,19.11 -69.64,16.98 -69.4,16.98 | -52.84,20.72 -52.84,20.76 -53.55,21.47 -53.55,21.27 -54.03,20.79 | -53.55,21.83 -53.5,21.78 -53.5,21.71 -52.61,20.82
  Top 0.305: -52.61,20.82 -52.35,20.56 v-52.35,20.23 | -52.61,20.82 -52.58,20.22 v-52.35,20.23 | -52.61,20.82 -52.19,20.39 v-52.35,20.23 | -41.53,27.91 -42.13,27.86 v-42.11,27.64 | -41.53,27.91 -41.95,27.48 v-42.11,27.64 | -48.81,20.2 -49.27,20.45 v-49.35,20.29 | -48.72,20.2 -49.3,20.07 v-49.35,20.29 | -57.37,34.48 -56.91,34.87 v-57.06,35.04 | -57.37,34.48 -57.28,35.08 v-57.06,35.04 | -57.51,34.59 -56.96,34.84 v-57.06,35.04 | -57.51,34.59 -57.26,35.14 v-57.06,35.04 | -71.21,20.82 -71.21,23.55 -71,23.76
  Top 0.406: C45.1 -44.92,24.1 -44.92,23.86 -44.5,23.43 | -44.5,23.43 v-44.04,22.98 | -53.55,22.73 -54.62,23.8 D13.2 -54.56,23.97 -54.34,23.97 -53.55,23.18 -53.55,22.73 | -53.55,22.73 -53.55,21.83 -53.55,21.47 -53.55,20.9 -53.66,20.79 | -44.5,23.43 -44.19,22.89 v-44.04,22.98 | -44.5,23.43 -43.96,23.13 v-44.04,22.98 | -58.36,19.19 -59.07,19.89 R45.2
  Top 0.508: v-70.56,37.72 v-70.55,37.71 -69.92,37.71 | -69.92,37.71 -69.72,37.71 C57.1 | -69.92,37.71 -70.53,37.84 v-70.56,37.72 | -69.92,37.71 -70.54,37.6 v-70.56,37.72